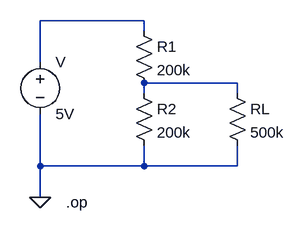
[diagram p0: schematic T4_1_VD.asc]
T4_1_VD.asc, the LTspice schematic file:
Version 4
SHEET 1 880 680
WIRE 272 48 112 48
WIRE 272 64 272 48
WIRE 112 112 112 48
WIRE 416 144 272 144
WIRE 272 160 272 144
WIRE 416 160 416 144
WIRE 112 272 112 192
WIRE 272 272 272 240
WIRE 272 272 112 272
WIRE 416 272 416 240
WIRE 416 272 272 272
WIRE 112 320 112 272
FLAG 112 320 0
SYMBOL res 256 48 R0
SYMATTR InstName R1
SYMATTR Value 200k
SYMBOL res 256 144 R0
SYMATTR InstName R2
SYMATTR Value 200k
SYMBOL voltage 112 96 R0
SYMATTR InstName V
SYMATTR Value 5V
SYMBOL res 400 144 R0
SYMATTR InstName RL
SYMATTR Value 500k
TEXT 152 328 Left 2 !.op

The netlist it stands for:
* T4_1_VD.asc
R1 N001 N002 200k
R2 N002 0 200k
V N001 0 5V
RL N002 0 500k
.op
.backanno
.end